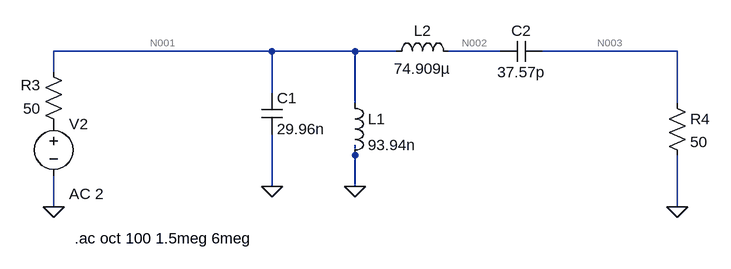
[diagram p0: schematic Draft2.asc]
Draft2.asc, the LTspice schematic file:
Version 4
SHEET 1 2408 680
WIRE 240 -640 -96 -640
WIRE 368 -640 240 -640
WIRE 432 -640 368 -640
WIRE 592 -640 512 -640
WIRE 864 -640 656 -640
WIRE -96 -608 -96 -640
WIRE 240 -576 240 -640
WIRE 368 -560 368 -640
WIRE 864 -560 864 -640
WIRE 368 -480 368 -496
WIRE 240 -432 240 -512
WIRE 368 -432 368 -480
WIRE -96 -400 -96 -448
WIRE 864 -400 864 -480
FLAG -96 -400 0
FLAG 864 -400 0
FLAG 240 -432 0
FLAG 368 -432 0
SYMBOL voltage -96 -544 R0
WINDOW 3 24 152 Left 2
WINDOW 123 24 124 Left 2
WINDOW 39 0 0 Left 0
SYMATTR Value ""
SYMATTR Value2 AC 2
SYMATTR InstName V2
SYMBOL res -80 -512 R180
WINDOW 0 36 76 Left 2
WINDOW 3 36 40 Left 2
SYMATTR InstName R3
SYMATTR Value 50
SYMBOL res 848 -576 R0
SYMATTR InstName R4
SYMATTR Value 50
SYMBOL cap 224 -576 R0
SYMATTR InstName C1
SYMATTR Value 29.96n
SYMBOL ind 352 -576 R0
SYMATTR InstName L1
SYMATTR Value 93.94n
SYMBOL ind 416 -624 R270
WINDOW 0 32 56 VTop 2
WINDOW 3 5 56 VBottom 2
SYMATTR InstName L2
SYMATTR Value 74.909µ
SYMBOL cap 656 -656 R90
WINDOW 0 0 32 VBottom 2
WINDOW 3 32 32 VTop 2
SYMATTR InstName C2
SYMATTR Value 37.57p
TEXT -64 -352 Left 2 !.ac oct 100 1.5meg 6meg

The netlist it stands for:
* Draft2.asc
V2 P001 0 AC 2
R3 P001 N001 50
R4 N003 0 50
C1 N001 0 29.96n
L1 N001 0 93.94n
L2 N001 N002 74.909µ
C2 N003 N002 37.57p
.ac oct 100 1.5meg 6meg
.backanno
.end

* Results of the author's LTspice run, read from the files saved beside the schematic
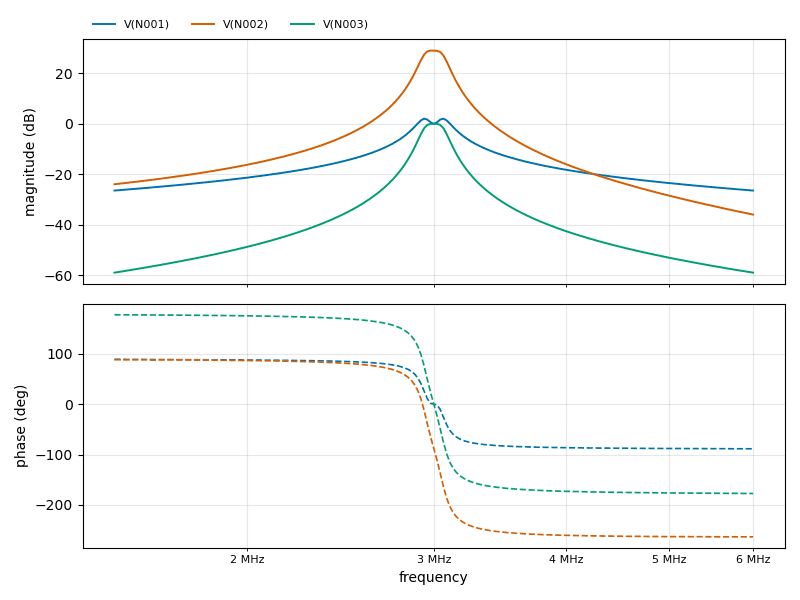
[diagram p1: AC Analysis of Draft2.asc, plotted from the saved traces]
* AC Analysis, 1 run:
*   V(N001): -26.52 dB at 1.5 MHz, -26.52 dB at 6 MHz, peak 2.00 dB at 3.063 MHz, 3 dB below the peak at 2.881 MHz and 3.124 MHz
*   V(N002): -24.02 dB at 1.5 MHz, -36.04 dB at 6 MHz, peak 28.98 dB at 2.979 MHz, 3 dB below the peak at 2.925 MHz and 3.073 MHz
*   V(N003): -59.06 dB at 1.5 MHz, -59.06 dB at 6 MHz, peak -0.07 dB at 3 MHz, 3 dB below the peak at 2.927 MHz and 3.075 MHz